# Altium schematic sheet SDRAM.SchDoc
size A3; DocumentNumber: 10; SheetNumber: 10; SheetTotal: 30
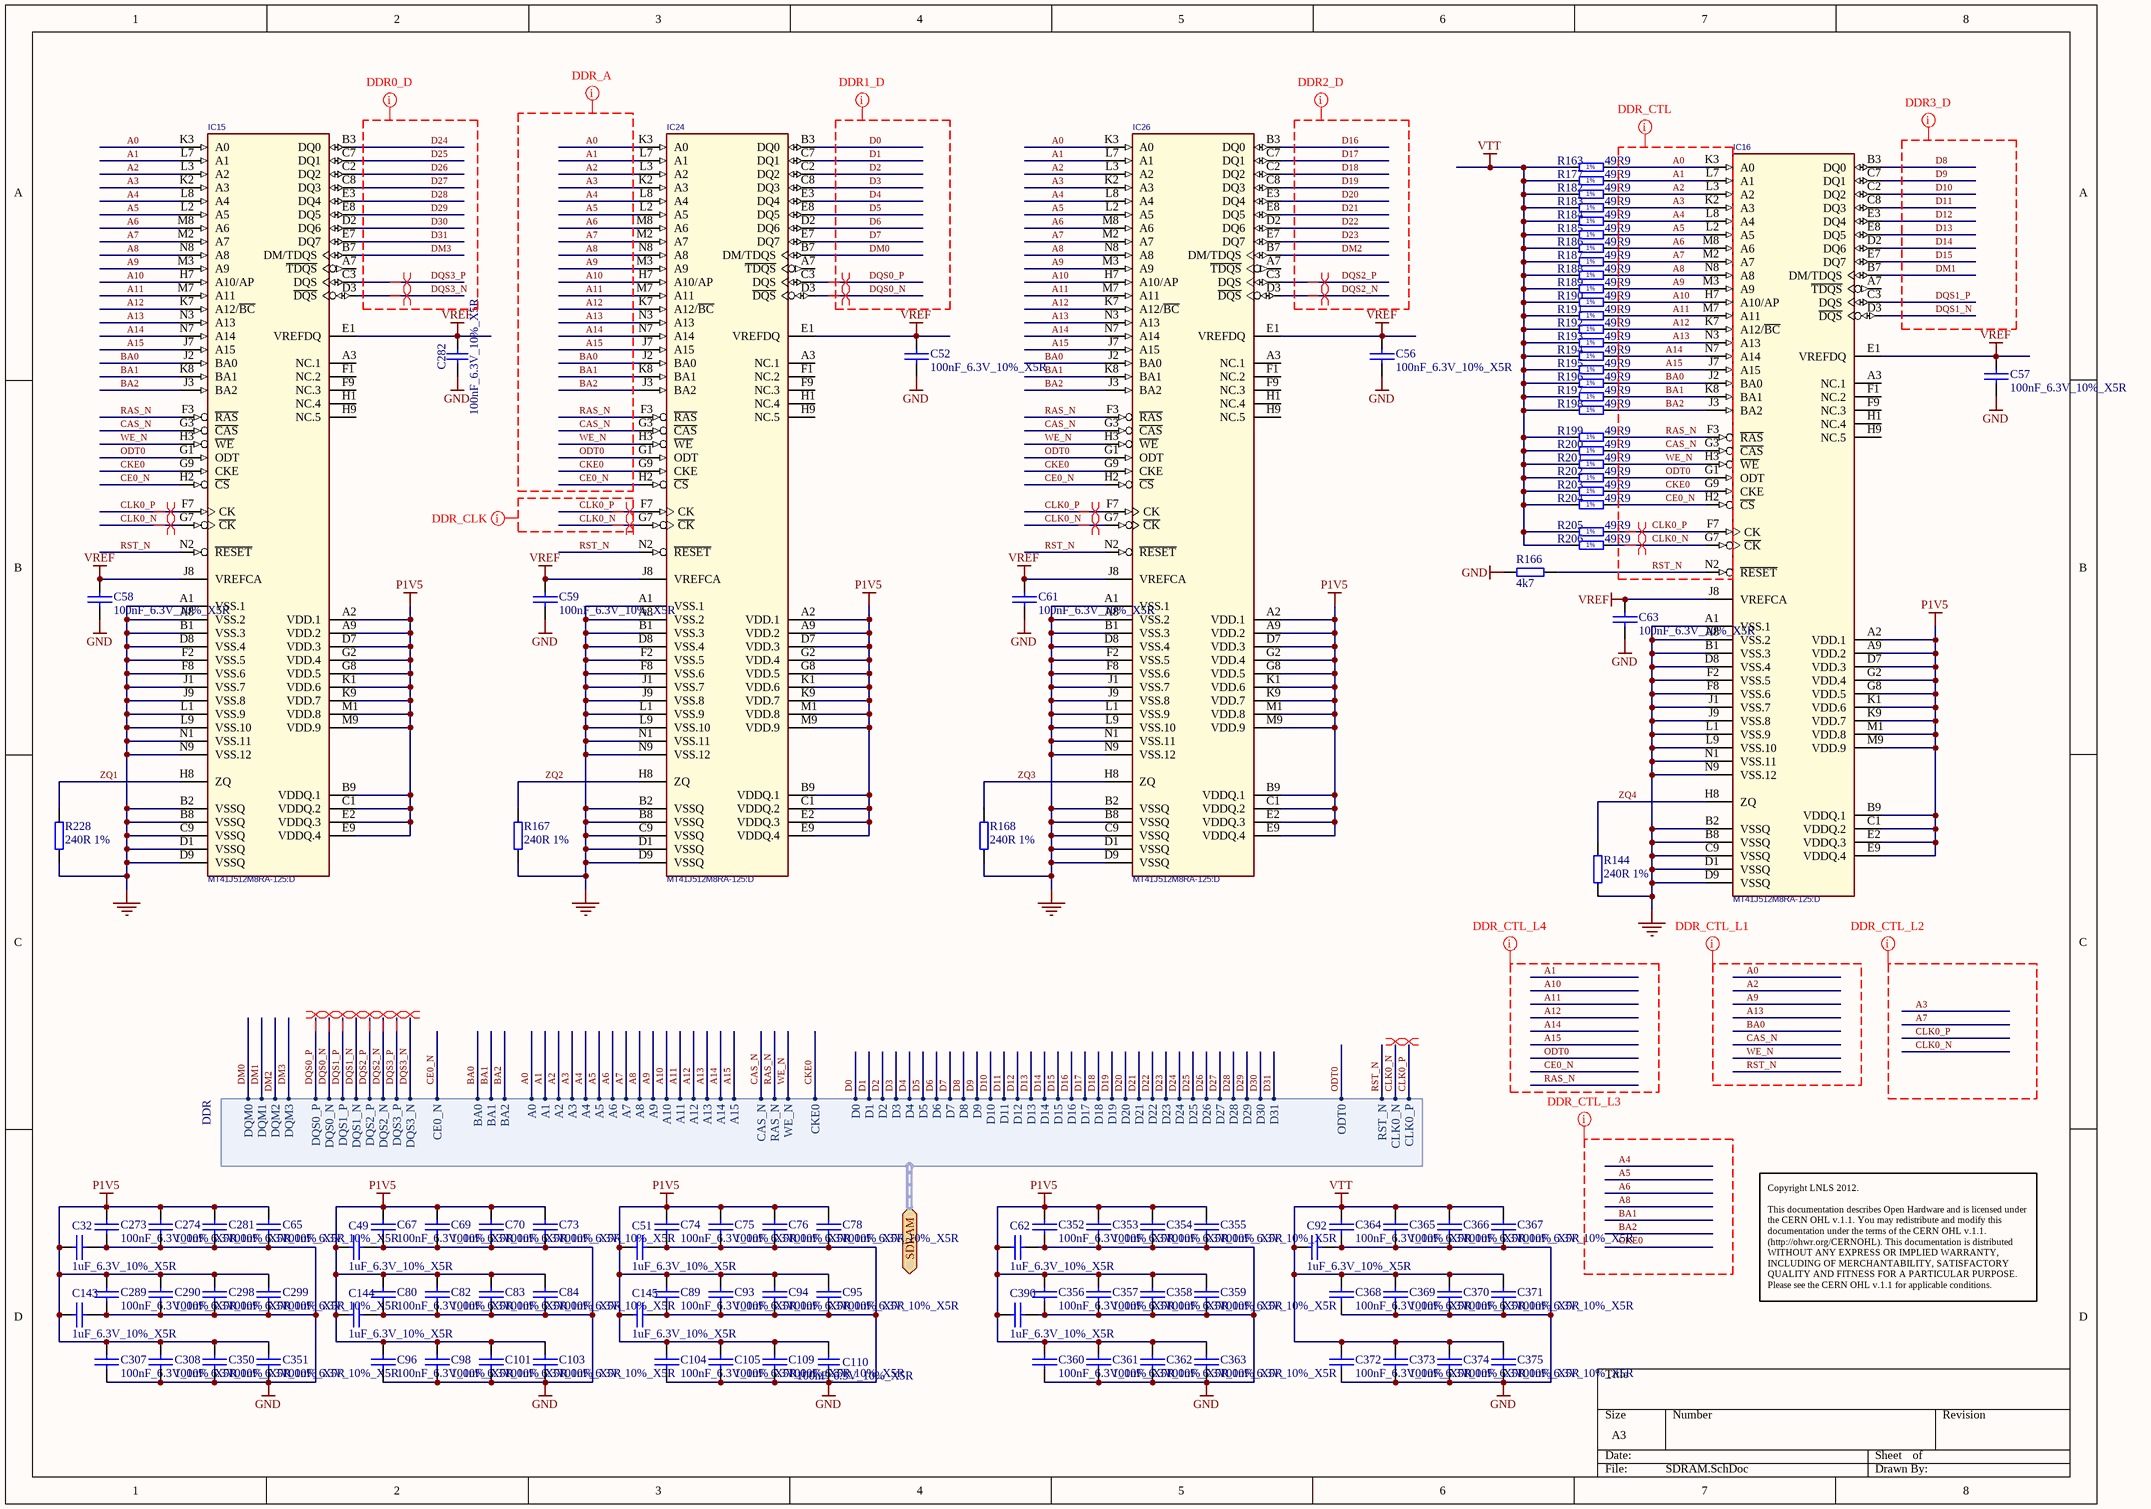
[diagram p0: SDRAM.SchDoc]

## Parts
C32  1uF_6.3V_10%_X5R  [0603C]
C49  1uF_6.3V_10%_X5R  [0603C]
C51  1uF_6.3V_10%_X5R  [0603C]
C52  100nF_6.3V_10%_X5R  [0201C]
C56  100nF_6.3V_10%_X5R  [0201C]
C57  100nF_6.3V_10%_X5R  [0201C]
C58  100nF_6.3V_10%_X5R  [0201C]
C59  100nF_6.3V_10%_X5R  [0201C]
C61  100nF_6.3V_10%_X5R  [0201C]
C62  1uF_6.3V_10%_X5R  [0603C]
C63  100nF_6.3V_10%_X5R  [0201C]
C65  100nF_6.3V_10%_X5R  [0201C]
C67  100nF_6.3V_10%_X5R  [0201C]
C69  100nF_6.3V_10%_X5R  [0201C]
C70  100nF_6.3V_10%_X5R  [0201C]
C73  100nF_6.3V_10%_X5R  [0201C]
C74  100nF_6.3V_10%_X5R  [0201C]
C75  100nF_6.3V_10%_X5R  [0201C]
C76  100nF_6.3V_10%_X5R  [0201C]
C78  100nF_6.3V_10%_X5R  [0201C]
C80  100nF_6.3V_10%_X5R  [0201C]
C82  100nF_6.3V_10%_X5R  [0201C]
C83  100nF_6.3V_10%_X5R  [0201C]
C84  100nF_6.3V_10%_X5R  [0201C]
C89  100nF_6.3V_10%_X5R  [0201C]
C92  1uF_6.3V_10%_X5R  [0603C]
C93  100nF_6.3V_10%_X5R  [0201C]
C94  100nF_6.3V_10%_X5R  [0201C]
C95  100nF_6.3V_10%_X5R  [0201C]
C96  100nF_6.3V_10%_X5R  [0201C]
C98  100nF_6.3V_10%_X5R  [0201C]
C101  100nF_6.3V_10%_X5R  [0201C]
C103  100nF_6.3V_10%_X5R  [0201C]
C104  100nF_6.3V_10%_X5R  [0201C]
C105  100nF_6.3V_10%_X5R  [0201C]
C109  100nF_6.3V_10%_X5R  [0201C]
C110  100nF_6.3V_10%_X5R  [CAPC0603X33N]
C143  1uF_6.3V_10%_X5R  [0603C]
C144  1uF_6.3V_10%_X5R  [0603C]
C145  1uF_6.3V_10%_X5R  [0603C]
C273  100nF_6.3V_10%_X5R  [0201C]
C274  100nF_6.3V_10%_X5R  [0201C]
C281  100nF_6.3V_10%_X5R  [0201C]
C282  100nF_6.3V_10%_X5R  [CAPC0603X33N]
C289  100nF_6.3V_10%_X5R  [0201C]
C290  100nF_6.3V_10%_X5R  [0201C]
C298  100nF_6.3V_10%_X5R  [0201C]
C299  100nF_6.3V_10%_X5R  [0201C]
C307  100nF_6.3V_10%_X5R  [0201C]
C308  100nF_6.3V_10%_X5R  [0201C]
C350  100nF_6.3V_10%_X5R  [0201C]
C351  100nF_6.3V_10%_X5R  [0201C]
C352  100nF_6.3V_10%_X5R  [0201C]
C353  100nF_6.3V_10%_X5R  [0201C]
C354  100nF_6.3V_10%_X5R  [0201C]
C355  100nF_6.3V_10%_X5R  [0201C]
C356  100nF_6.3V_10%_X5R  [0201C]
C357  100nF_6.3V_10%_X5R  [0201C]
C358  100nF_6.3V_10%_X5R  [0201C]
C359  100nF_6.3V_10%_X5R  [0201C]
C360  100nF_6.3V_10%_X5R  [0201C]
C361  100nF_6.3V_10%_X5R  [0201C]
C362  100nF_6.3V_10%_X5R  [0201C]
C363  100nF_6.3V_10%_X5R  [0201C]
C364  100nF_6.3V_10%_X5R  [0201C]
C365  100nF_6.3V_10%_X5R  [0201C]
C366  100nF_6.3V_10%_X5R  [0201C]
C367  100nF_6.3V_10%_X5R  [0201C]
C368  100nF_6.3V_10%_X5R  [0201C]
C369  100nF_6.3V_10%_X5R  [0201C]
C370  100nF_6.3V_10%_X5R  [0201C]
C371  100nF_6.3V_10%_X5R  [0201C]
C372  100nF_6.3V_10%_X5R  [0201C]
C373  100nF_6.3V_10%_X5R  [0201C]
C374  100nF_6.3V_10%_X5R  [0201C]
C375  100nF_6.3V_10%_X5R  [0201C]
C390  1uF_6.3V_10%_X5R  [0603C]
IC15  MT41J512M8RA-125:D  [bga6x13-p8-12p75]
IC16  MT41J512M8RA-125:D  [bga6x13-p8-12p75]
IC24  MT41J512M8RA-125:D  [bga6x13-p8-12p75]
IC26  MT41J512M8RA-125:D  [bga6x13-p8-12p75]
R144  240R 1%  [0402R]
R163  49R9  [RESC1005X40N]
R166  4k7  [0402R]
R167  240R 1%  [0402R]
R168  240R 1%  [0402R]
R177  49R9  [RESC1005X40N]
R182  49R9  [RESC1005X40N]
R183  49R9  [RESC1005X40N]
R184  49R9  [RESC1005X40N]
R185  49R9  [RESC1005X40N]
R186  49R9  [RESC1005X40N]
R187  49R9  [RESC1005X40N]
R188  49R9  [RESC1005X40N]
R189  49R9  [RESC1005X40N]
R190  49R9  [RESC1005X40N]
R191  49R9  [RESC1005X40N]
R192  49R9  [RESC1005X40N]
R193  49R9  [RESC1005X40N]
R194  49R9  [RESC1005X40N]
R195  49R9  [RESC1005X40N]
R196  49R9  [RESC1005X40N]
R197  49R9  [RESC1005X40N]
R198  49R9  [RESC1005X40N]
R199  49R9  [RESC1005X40N]
R200  49R9  [RESC1005X40N]
R201  49R9  [RESC1005X40N]
R202  49R9  [RESC1005X40N]
R203  49R9  [RESC1005X40N]
R204  49R9  [RESC1005X40N]
R205  49R9  [RESC1005X40N]
R206  49R9  [RESC1005X40N]
R228  240R 1%  [0402R]

## Ports
SDRAM (harness DDR)

## Harnesses
DDR: CKE0, A0, A1, A2, A3, A4, A5, A7, A8, A9, A10, A11, A12, A13, BA0, BA1, BA2, A14, A15, CAS_N, RAS_N, WE_N, CE0_N, DQM0, DQM1, A6, D0, D1, D2, D3, D4, D5, D6, D7, D8, D9, D10, D11, D12, D13, D14, D15, CLK0_N, CLK0_P, ODT0, RST_N, D16, D17, D18, D19, D20, D21, D22, D23, D24, D25, D26, D27, D28, D29, D30, D31, DQS0_P, DQS1_P, DQS0_N, DQS1_N, DQS3_N, DQS3_P, DQS2_P, DQS2_N, DQM2, DQM3

## Nets
GND: C32.2 C49.2 C51.2 C52.2 C56.2 C57.2 C58.2 C59.2 C61.2 C62.2 C63.2 C65.2 C67.2 C69.2 C70.2 C73.2 C74.2 C75.2 C76.2 C78.2 C80.2 C82.2 C83.2 C84.2 C89.2 C92.2 C93.2 C94.2 C95.2 C96.2 C98.2 C101.2 C103.2 C104.2 C105.2 C109.2 C110.1 C143.2 C144.2 C145.2 C273.2 C274.2 C281.2 C282.1 C289.2 C290.2 C298.2 C299.2 C307.2 C308.2 C350.2 C351.2 C352.2 C353.2 C354.2 C355.2 C356.2 C357.2 C358.2 C359.2 C360.2 C361.2 C362.2 C363.2 C364.2 C365.2 C366.2 C367.2 C368.2 C369.2 C370.2 C371.2 C372.2 C373.2 C374.2 C375.2 C390.2 IC15.A1(VSS.1) IC15.A8(VSS.2) IC15.B1(VSS.3) IC15.B2(VSSQ) IC15.B8(VSSQ) IC15.C9(VSSQ) IC15.D1(VSSQ) IC15.D8(VSS.4) IC15.D9(VSSQ) IC15.F2(VSS.5) IC15.F8(VSS.6) IC15.J1(VSS.7) IC15.J9(VSS.8) IC15.L1(VSS.9) IC15.L9(VSS.10) IC15.N1(VSS.11) IC15.N9(VSS.12) IC16.A1(VSS.1) IC16.A8(VSS.2) IC16.B1(VSS.3) IC16.B2(VSSQ) IC16.B8(VSSQ) IC16.C9(VSSQ) IC16.D1(VSSQ) IC16.D8(VSS.4) IC16.D9(VSSQ) IC16.F2(VSS.5) IC16.F8(VSS.6) IC16.J1(VSS.7) IC16.J9(VSS.8) IC16.L1(VSS.9) IC16.L9(VSS.10) IC16.N1(VSS.11) IC16.N9(VSS.12) IC24.A1(VSS.1) IC24.A8(VSS.2) IC24.B1(VSS.3) IC24.B2(VSSQ) IC24.B8(VSSQ) IC24.C9(VSSQ) IC24.D1(VSSQ) IC24.D8(VSS.4) IC24.D9(VSSQ) IC24.F2(VSS.5) IC24.F8(VSS.6) IC24.J1(VSS.7) IC24.J9(VSS.8) IC24.L1(VSS.9) IC24.L9(VSS.10) IC24.N1(VSS.11) IC24.N9(VSS.12) IC26.A1(VSS.1) IC26.A8(VSS.2) IC26.B1(VSS.3) IC26.B2(VSSQ) IC26.B8(VSSQ) IC26.C9(VSSQ) IC26.D1(VSSQ) IC26.D8(VSS.4) IC26.D9(VSSQ) IC26.F2(VSS.5) IC26.F8(VSS.6) IC26.J1(VSS.7) IC26.J9(VSS.8) IC26.L1(VSS.9) IC26.L9(VSS.10) IC26.N1(VSS.11) IC26.N9(VSS.12) R144.1 R166.2 R167.1 R168.1 R228.1
P1V5: C32.1 C49.1 C51.1 C62.1 C65.1 C67.1 C69.1 C70.1 C73.1 C74.1 C75.1 C76.1 C78.1 C80.1 C82.1 C83.1 C84.1 C89.1 C93.1 C94.1 C95.1 C96.1 C98.1 C101.1 C103.1 C104.1 C105.1 C109.1 C110.2 C143.1 C144.1 C145.1 C273.1 C274.1 C281.1 C289.1 C290.1 C298.1 C299.1 C307.1 C308.1 C350.1 C351.1 C352.1 C353.1 C354.1 C355.1 C356.1 C357.1 C358.1 C359.1 C360.1 C361.1 C362.1 C363.1 C390.1 IC15.A2(VDD.1) IC15.A9(VDD.2) IC15.B9(VDDQ.1) IC15.C1(VDDQ.2) IC15.D7(VDD.3) IC15.E2(VDDQ.3) IC15.E9(VDDQ.4) IC15.G2(VDD.4) IC15.G8(VDD.5) IC15.K1(VDD.6) IC15.K9(VDD.7) IC15.M1(VDD.8) IC15.M9(VDD.9) IC16.A2(VDD.1) IC16.A9(VDD.2) IC16.B9(VDDQ.1) IC16.C1(VDDQ.2) IC16.D7(VDD.3) IC16.E2(VDDQ.3) IC16.E9(VDDQ.4) IC16.G2(VDD.4) IC16.G8(VDD.5) IC16.K1(VDD.6) IC16.K9(VDD.7) IC16.M1(VDD.8) IC16.M9(VDD.9) IC24.A2(VDD.1) IC24.A9(VDD.2) IC24.B9(VDDQ.1) IC24.C1(VDDQ.2) IC24.D7(VDD.3) IC24.E2(VDDQ.3) IC24.E9(VDDQ.4) IC24.G2(VDD.4) IC24.G8(VDD.5) IC24.K1(VDD.6) IC24.K9(VDD.7) IC24.M1(VDD.8) IC24.M9(VDD.9) IC26.A2(VDD.1) IC26.A9(VDD.2) IC26.B9(VDDQ.1) IC26.C1(VDDQ.2) IC26.D7(VDD.3) IC26.E2(VDDQ.3) IC26.E9(VDDQ.4) IC26.G2(VDD.4) IC26.G8(VDD.5) IC26.K1(VDD.6) IC26.K9(VDD.7) IC26.M1(VDD.8) IC26.M9(VDD.9)
VREF: C52.1 C56.1 C57.1 C58.1 C59.1 C61.1 C63.1 C282.2 IC15.E1(VREFDQ) IC15.J8(VREFCA) IC16.E1(VREFDQ) IC16.J8(VREFCA) IC24.E1(VREFDQ) IC24.J8(VREFCA) IC26.E1(VREFDQ) IC26.J8(VREFCA)
VTT: C92.1 C364.1 C365.1 C366.1 C367.1 C368.1 C369.1 C370.1 C371.1 C372.1 C373.1 C374.1 C375.1 R163.1 R177.1 R182.1 R183.1 R184.1 R185.1 R186.1 R187.1 R188.1 R189.1 R190.1 R191.1 R192.1 R193.1 R194.1 R195.1 R196.1 R197.1 R198.1 R199.1 R200.1 R201.1 R202.1 R203.1 R204.1 R205.1 R206.1
A0: IC15.K3(A0) IC16.K3(A0) IC24.K3(A0) IC26.K3(A0) R163.2 ; port SDRAM.A0
A1: IC15.L7(A1) IC16.L7(A1) IC24.L7(A1) IC26.L7(A1) R177.2 ; port SDRAM.A1
A2: IC15.L3(A2) IC16.L3(A2) IC24.L3(A2) IC26.L3(A2) R182.2 ; port SDRAM.A2
A3: IC15.K2(A3) IC16.K2(A3) IC24.K2(A3) IC26.K2(A3) R183.2 ; port SDRAM.A3
A4: IC15.L8(A4) IC16.L8(A4) IC24.L8(A4) IC26.L8(A4) R184.2 ; port SDRAM.A4
A5: IC15.L2(A5) IC16.L2(A5) IC24.L2(A5) IC26.L2(A5) R185.2 ; port SDRAM.A5
A6: IC15.M8(A6) IC16.M8(A6) IC24.M8(A6) IC26.M8(A6) R186.2 ; port SDRAM.A6
A7: IC15.M2(A7) IC16.M2(A7) IC24.M2(A7) IC26.M2(A7) R187.2 ; port SDRAM.A7
A8: IC15.N8(A8) IC16.N8(A8) IC24.N8(A8) IC26.N8(A8) R188.2 ; port SDRAM.A8
A9: IC15.M3(A9) IC16.M3(A9) IC24.M3(A9) IC26.M3(A9) R189.2 ; port SDRAM.A9
A10: IC15.H7(A10/AP) IC16.H7(A10/AP) IC24.H7(A10/AP) IC26.H7(A10/AP) R190.2 ; port SDRAM.A10
A11: IC15.M7(A11) IC16.M7(A11) IC24.M7(A11) IC26.M7(A11) R191.2 ; port SDRAM.A11
A12: IC15.K7(A12/~{BC}) IC16.K7(A12/~{BC}) IC24.K7(A12/~{BC}) IC26.K7(A12/~{BC}) R192.2 ; port SDRAM.A12
A13: IC15.N3(A13) IC16.N3(A13) IC24.N3(A13) IC26.N3(A13) R193.2 ; port SDRAM.A13
A14: IC15.N7(A14) IC16.N7(A14) IC24.N7(A14) IC26.N7(A14) R194.2 ; port SDRAM.A14
A15: IC15.J7(A15) IC16.J7(A15) IC24.J7(A15) IC26.J7(A15) R195.2 ; port SDRAM.A15
BA0: IC15.J2(BA0) IC16.J2(BA0) IC24.J2(BA0) IC26.J2(BA0) R196.2 ; port SDRAM.BA0
BA1: IC15.K8(BA1) IC16.K8(BA1) IC24.K8(BA1) IC26.K8(BA1) R197.2 ; port SDRAM.BA1
BA2: IC15.J3(BA2) IC16.J3(BA2) IC24.J3(BA2) IC26.J3(BA2) R198.2 ; port SDRAM.BA2
CAS_N: IC15.G3(~{CAS}) IC16.G3(~{CAS}) IC24.G3(~{CAS}) IC26.G3(~{CAS}) R200.2 ; port SDRAM.CAS_N
CE0_N: IC15.H2(~{CS}) IC16.H2(~{CS}) IC24.H2(~{CS}) IC26.H2(~{CS}) R204.2 ; port SDRAM.CE0_N
CKE0: IC15.G9(CKE) IC16.G9(CKE) IC24.G9(CKE) IC26.G9(CKE) R203.2 ; port SDRAM.CKE0
CLK0_N: IC15.G7(~{CK}) IC16.G7(~{CK}) IC24.G7(~{CK}) IC26.G7(~{CK}) R206.2 ; port SDRAM.CLK0_N
CLK0_P: IC15.F7(CK) IC16.F7(CK) IC24.F7(CK) IC26.F7(CK) R205.2 ; port SDRAM.CLK0_P
D0: IC24.B3(DQ0) ; port SDRAM.D0
D1: IC24.C7(DQ1) ; port SDRAM.D1
D2: IC24.C2(DQ2) ; port SDRAM.D2
D3: IC24.C8(DQ3) ; port SDRAM.D3
D4: IC24.E3(DQ4) ; port SDRAM.D4
D5: IC24.E8(DQ5) ; port SDRAM.D5
D6: IC24.D2(DQ6) ; port SDRAM.D6
D7: IC24.E7(DQ7) ; port SDRAM.D7
D8: IC16.B3(DQ0) ; port SDRAM.D8
D9: IC16.C7(DQ1) ; port SDRAM.D9
D10: IC16.C2(DQ2) ; port SDRAM.D10
D11: IC16.C8(DQ3) ; port SDRAM.D11
D12: IC16.E3(DQ4) ; port SDRAM.D12
D13: IC16.E8(DQ5) ; port SDRAM.D13
D14: IC16.D2(DQ6) ; port SDRAM.D14
D15: IC16.E7(DQ7) ; port SDRAM.D15
D16: IC26.B3(DQ0) ; port SDRAM.D16
D17: IC26.C7(DQ1) ; port SDRAM.D17
D18: IC26.C2(DQ2) ; port SDRAM.D18
D19: IC26.C8(DQ3) ; port SDRAM.D19
D20: IC26.E3(DQ4) ; port SDRAM.D20
D21: IC26.E8(DQ5) ; port SDRAM.D21
D22: IC26.D2(DQ6) ; port SDRAM.D22
D23: IC26.E7(DQ7) ; port SDRAM.D23
D24: IC15.B3(DQ0) ; port SDRAM.D24
D25: IC15.C7(DQ1) ; port SDRAM.D25
D26: IC15.C2(DQ2) ; port SDRAM.D26
D27: IC15.C8(DQ3) ; port SDRAM.D27
D28: IC15.E3(DQ4) ; port SDRAM.D28
D29: IC15.E8(DQ5) ; port SDRAM.D29
D30: IC15.D2(DQ6) ; port SDRAM.D30
D31: IC15.E7(DQ7) ; port SDRAM.D31
DM0: IC24.B7(DM/TDQS) ; port SDRAM.DQM0
DM1: IC16.B7(DM/TDQS) ; port SDRAM.DQM1
DM2: IC26.B7(DM/TDQS) ; port SDRAM.DQM2
DM3: IC15.B7(DM/TDQS) ; port SDRAM.DQM3
DQS0_N: IC24.D3(~{DQS}) ; port SDRAM.DQS0_N
DQS0_P: IC24.C3(DQS) ; port SDRAM.DQS0_P
DQS1_N: IC16.D3(~{DQS}) ; port SDRAM.DQS1_N
DQS1_P: IC16.C3(DQS) ; port SDRAM.DQS1_P
DQS2_N: IC26.D3(~{DQS}) ; port SDRAM.DQS2_N
DQS2_P: IC26.C3(DQS) ; port SDRAM.DQS2_P
DQS3_N: IC15.D3(~{DQS}) ; port SDRAM.DQS3_N
DQS3_P: IC15.C3(DQS) ; port SDRAM.DQS3_P
ODT0: IC15.G1(ODT) IC16.G1(ODT) IC24.G1(ODT) IC26.G1(ODT) R202.2 ; port SDRAM.ODT0
RAS_N: IC15.F3(~{RAS}) IC16.F3(~{RAS}) IC24.F3(~{RAS}) IC26.F3(~{RAS}) R199.2 ; port SDRAM.RAS_N
RST_N: IC15.N2(~{RESET}) IC16.N2(~{RESET}) IC24.N2(~{RESET}) IC26.N2(~{RESET}) R166.1 ; port SDRAM.RST_N
WE_N: IC15.H3(~{WE}) IC16.H3(~{WE}) IC24.H3(~{WE}) IC26.H3(~{WE}) R201.2 ; port SDRAM.WE_N
ZQ1: IC15.H8(ZQ) R228.2
ZQ2: IC24.H8(ZQ) R167.2
ZQ3: IC26.H8(ZQ) R168.2
ZQ4: IC16.H8(ZQ) R144.2

Not connected (* = marked no-connect by the designer): IC15 A3(NC.1) A7(~{TDQS}) F1(NC.2) F9(NC.3) H1(NC.4) H9(NC.5); IC16 A3(NC.1) A7(~{TDQS}) F1(NC.2) F9(NC.3) H1(NC.4) H9(NC.5); IC24 A3(NC.1) A7(~{TDQS}) F1(NC.2) F9(NC.3) H1(NC.4) H9(NC.5); IC26 A3(NC.1) A7(~{TDQS}) F1(NC.2) F9(NC.3) H1(NC.4) H9(NC.5)

## Layout directives
differential pair: CLK0_N, CLK0_P, DQS0_N, DQS0_P, DQS1_N, DQS1_P, DQS2_N, DQS2_P, DQS3_N, DQS3_P
net class DDR1_D: D0, D1, D2, D3, D4, D5, D6, D7, DM0, DQS0_N, DQS0_P
net class DDR_A: A0, A1, A2, A3, A4, A5, A6, A7, A8, A9, A10, A11, A12, A13, A14, A15, BA0, BA1, BA2, CAS_N, CE0_N, CKE0, ODT0, RAS_N, WE_N
net class DDR0_D: D24, D25, D26, D27, D28, D29, D30, D31, DM3, DQS3_N, DQS3_P
net class DDR2_D: D16, D17, D18, D19, D20, D21, D22, D23, DM2, DQS2_N, DQS2_P
net class DDR3_D: D8, D9, D10, D11, D12, D13, D14, D15, DM1, DQS1_N, DQS1_P
net class DDR_CLK: CLK0_N, CLK0_P
net class DDR_CTL: A0, A1, A2, A3, A4, A5, A6, A7, A8, A9, A10, A11, A12, A13, A14, A15, BA0, BA1, BA2, CAS_N, CE0_N, CKE0, CLK0_N, CLK0_P, ODT0, RAS_N, RST_N, WE_N
net class DDR_CTL_L4: A1, A10, A11, A12, A14, A15, CE0_N, ODT0, RAS_N
net class DDR_CTL_L1: A0, A2, A9, A13, BA0, CAS_N, RST_N, WE_N
net class DDR_CTL_L2: A3, A7, CLK0_N, CLK0_P
net class DDR_CTL_L3: A4, A5, A6, A8, BA1, BA2, CKE0

## Notes on the sheet
- Copyright LNLS 2012.
  This documentation describes Open Hardware and is licensed under the CERN OHL v.1.1. You may redistribute and modify this documentation under the terms of the CERN OHL v.1.1. (http://ohwr.org/CERNOHL). This documentation is distributed WITHOUT ANY EXPRESS OR IMPLIED WARRANTY, INCLUDING OF MERCHANTABILITY, SATISFACTORY QUALITY AND FITNESS FOR A PARTICULAR PURPOSE. Please see the CERN OHL v.1.1 for applicable conditions.
- (in symbol R0402_43R_1%_0.0625W_100PPM) 1%

## Library data of the parts
C32 C49 C51 C62 C92 C143-C145 C390 = CAP_SMD_0603: Capacitor SMD; Supplier 1: Digi-Key; Supplier Part Number 1: 490-1524-2-ND
C52 C56-C59 C61 C63 C65 C67 C69 C70 C73-C76 C78 C80 C82-C84 C89 C93-C96 C98 C101 C103-C105 C109 C273 C274 C281 C289 C290 C298 C299 C307 C308 C350-C375 = CAP_SMD_0201: Capacitor SMD
C110 C282 = CC0201_100NF_6.3V_10%_X5R: Non-polarised capacitor; Part Description: SMD Multilayer Chip Ceramic Capacitor; Manufacturer: GENERIC; Manufacturer1 Part Number: 02016D104KAT2A; Value: 100nF; Voltage: 6.3V; TC: X5R; Tolerance: ±10%; Table: Capacitors SMD; Part Number: CC0201_100NF_6.3V_10%_X5R; Component Kind: Standard; Component Type: Standard; Pin Count: 2; Status: Not Recommended; Manufacturer Part Number: CC0201_100NF_6.3V_10%_X5R; Case: 0201; Mounted: Yes; Socket: No; SMD: Yes; Manufacturer1 Example: AVX; Manufacturer1 ComponentHeight: 0.33mm; HelpURL: \\cern.ch\dfs\Applications\Altium\Datasheets\CC0201_X5R_AVX.pdf; Author: CERN DEM JLC; CreateDate: 2007-12-03; LatestRevisionDate: 2007-12-03
IC15 IC16 IC24 IC26 = MEM_MT41J512M8: 512x8 DDR3 SDRAM; Supplier 1: Arrow; Supplier Part Number 1: 51515418S9110300N2406
R144 R166-R168 R228 = RES_0402: SMD Resistor; Supplier 1: Newark; Supplier Part Number 1: 59M6691
R163 R177 R182-R206 = R0402_43R_1%_0.0625W_100PPM: Resistor - 1%; Part Number: R0402_49R9_1%_0.0625W_100PPM; Part Description: General Purpose Thick Film Chip Resistor; Manufacturer: GENERIC; Manufacturer1 Part Number: 232270674309; TC: ±100ppm/°C; Table: Resistors SMD; Component Kind: Standard; Component Type: Standard; Pin Count: 2; Value: 49R9; Status: Not recommended; Power: 0.0625W; Tolerance: ±1%; Manufacturer Part Number: R0402_49R9_1%_0.0625W_100PPM; Case: 0402; Mounted: Yes; Socket: No; SMD: Yes; Manufacturer1 Example: PHYCOMP; Manufacturer1 ComponentHeight: 0.4mm; HelpURL: \\cern.ch\dfs\Applications\Altium\Datasheets\R0402_Phycomp_RC0402.pdf; Author: CERN DEM JLC; CreateDate: 2007-12-03; LatestRevisionDate: 2008-03-13